# EAGLE design POV (EAGLE 9.6.2)

## Sheet 1 of 2
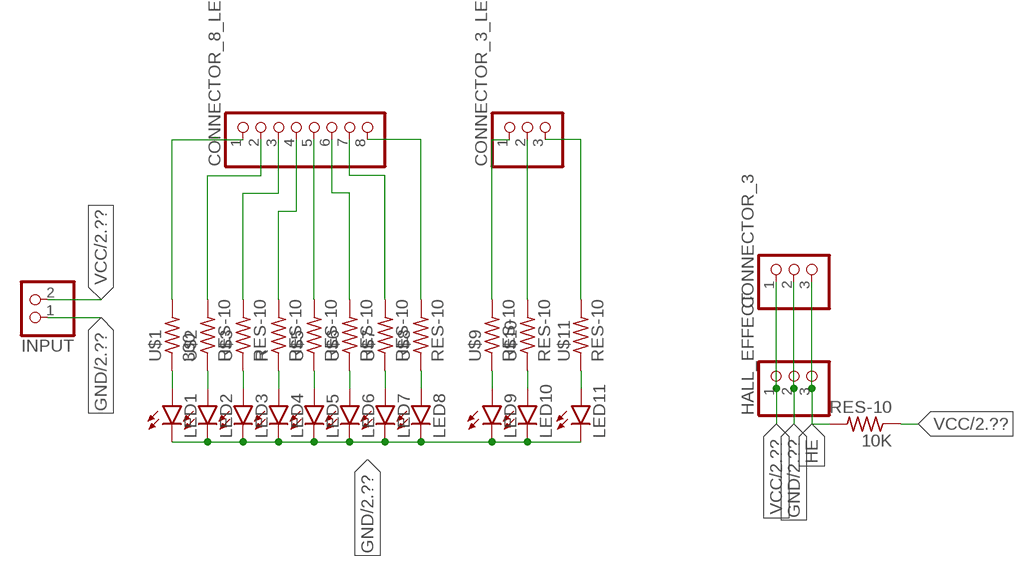
[diagram p0: schematic, sheet 1]

### Parts
10K  RES-10  [0207/10]
CONNECTOR_3  PINHD-1X3  [1X03]
CONNECTOR_3_LED  PINHD-1X3  [1X03]
CONNECTOR_8_LED  PINHD-1X8  [1X08]
HALL_EFFECT  PINHD-1X3  [1X03]
INPUT  PINHD-1X2  [1X02]
LED1  LED5MM  [LED5MM]
LED2  LED5MM  [LED5MM]
LED3  LED5MM  [LED5MM]
LED4  LED5MM  [LED5MM]
LED5  LED5MM  [LED5MM]
LED6  LED5MM  [LED5MM]
LED7  LED5MM  [LED5MM]
LED8  LED5MM  [LED5MM]
LED9  LED5MM  [LED5MM]
LED10  LED5MM  [LED5MM]
LED11  LED5MM  [LED5MM]
R  RES-10  [0207/10]
U$1  330  RES-10  [0207/10]
U$2  RES-10  [0207/10]
U$3  RES-10  [0207/10]
U$5  RES-10  [0207/10]
U$6  RES-10  [0207/10]
U$7  RES-10  [0207/10]
U$8  RES-10  [0207/10]
U$9  RES-10  [0207/10]
U$10  RES-10  [0207/10]
U$11  RES-10  [0207/10]

### Nets
GND: CONNECTOR_3.2 HALL_EFFECT.2 INPUT.1 LED1.K(C) LED2.K(C) LED3.K(C) LED4.K(C) LED5.K(C) LED6.K(C) LED7.K(C) LED8.K(C) LED9.K(C) LED10.K(C) LED11.K(C) ; also sheet 2
HE: 10K.2 CONNECTOR_3.3 HALL_EFFECT.3
N$2: LED1.A U$1.1
N$3: LED2.A U$2.1
N$4: LED3.A U$3.1
N$5: LED4.A R.1
N$6: LED5.A U$5.1
N$7: LED6.A U$6.1
N$8: LED7.A U$7.1
N$9: LED8.A U$8.1
N$10: LED9.A U$9.1
N$11: LED10.A U$10.1
N$12: LED11.A U$11.1
N$13: CONNECTOR_8_LED.1 U$1.2
N$14: CONNECTOR_8_LED.2 U$2.2
N$15: CONNECTOR_8_LED.3 U$3.2
N$16: CONNECTOR_8_LED.4 R.2
N$17: CONNECTOR_8_LED.5 U$5.2
N$18: CONNECTOR_8_LED.6 U$6.2
N$19: CONNECTOR_8_LED.7 U$7.2
N$20: CONNECTOR_8_LED.8 U$8.2
N$21: CONNECTOR_3_LED.1 U$9.2
N$22: CONNECTOR_3_LED.2 U$10.2
N$23: CONNECTOR_3_LED.3 U$11.2
VCC: 10K.1 CONNECTOR_3.1 HALL_EFFECT.1 INPUT.2 ; also sheet 2

## Sheet 2 of 2
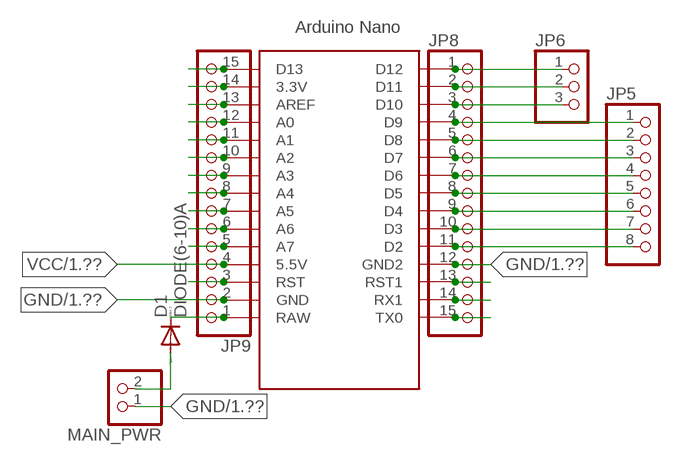
[diagram p1: schematic, sheet 2]

### Parts
D1  DIODE(6-10)A  [DO201-15]
JP5  PINHD-1X8  [1X08]
JP6  PINHD-1X3  [1X03]
JP8  PINHD-1X15  [1X15]
JP9  PINHD-1X15  [1X15]
MAIN_PWR  PINHD-1X2  [1X02]
U$12  ARDUINO_NANO  [NANO]

### Nets
GND: JP8.12 JP9.2 MAIN_PWR.1 U$12.GND U$12.GND1(GND2) ; also sheet 1
N$1: JP9.14 U$12.3.3V
N$24: JP9.13 U$12.AREF
N$25: JP8.15 U$12.TX0
N$26: JP8.14 U$12.RX1
N$27: JP8.13 U$12.RST1
N$29: JP5.8 JP8.11 U$12.D2
N$30: JP5.7 JP8.10 U$12.D3
N$31: JP5.6 JP8.9 U$12.D4
N$32: JP5.5 JP8.8 U$12.D5
N$33: JP5.4 JP8.7 U$12.D6
N$34: JP5.3 JP8.6 U$12.D7
N$35: JP5.2 JP8.5 U$12.D8
N$36: JP5.1 JP8.4 U$12.D9
N$37: D1.C JP9.1 U$12.RAW
N$38: D1.A MAIN_PWR.2
N$40: JP9.3 U$12.RST
N$59: JP9.9 U$12.A3
N$71: JP9.10 U$12.A2
N$77: JP9.11 U$12.A1
N$78: JP9.12 U$12.A0
N$79: JP9.15 U$12.D13
N$80: JP6.1 JP8.1 U$12.D12
N$81: JP6.2 JP8.2 U$12.D11
N$82: JP6.3 JP8.3 U$12.D10
N$83: JP9.5 U$12.A7
N$84: JP9.6 U$12.A6
N$85: JP9.7 U$12.A5
N$86: JP9.8 U$12.A4
VCC: JP9.4 U$12.5V(5.5V) ; also sheet 1

## Library data of the parts
10K R U$1-U$3 U$5-U$11 = MIA_LIBRARY-2-2-2:RES-10
CONNECTOR_3 CONNECTOR_3_LED HALL_EFFECT = pinhead:PINHD-1X3: PIN HEADER
CONNECTOR_8_LED = pinhead:PINHD-1X8: PIN HEADER
D1 = MIA_LIBRARY-2-2-2:DIODE(6-10)A: DIODE controlled avalanche rectifier
INPUT = pinhead:PINHD-1X2: PIN HEADER
JP5 = MIA_LIBRARY-2-2-2:PINHD-1X8: PIN HEADER
JP6 = MIA_LIBRARY-2-2-2:PINHD-1X3: PIN HEADER
JP8 JP9 = MIA_LIBRARY-2-2-2:PINHD-1X15: PIN HEADER
LED1-LED11 = led:LED: LED OSRAM: - CHIPLED LG R971, LG N971, LY N971, LG Q971, LY Q971, LO R971, LY R971 LH N974, LH R974 LS Q976, LO Q976, LY Q976 LO Q996 - Hyper CHIPLED LW Q18S LB Q993, LB Q99A, LB R99A - SideLED LS A670, LO A670, LY A670, LG A670, LP A670 LB A673, LV A673, LT A673, LW A673 LH A674 LY A675 LS A676, LA A676, LO A676, LY A676, LW A676 LS A679, LY A679, LG A679 - Hyper Micro SIDELED® LS Y876, LA Y876, LO Y876, LY Y876 LT Y87S - SmartLED LW L88C, LW L88S LB L89C, LB L89S, LG L890 LS L89K, LO L89K, LY L89K LS L896, LA L896, LO L896, LY L896 - TOPLED LS T670, LO T670, LY T670, LG T670, LP T670 LSG T670, LSP T670, LSY T670, LOP T670, LYG T670 LG T671, LOG T671, LSG T671 LB T673, LV T673, LT T673, LW T673 LH T674 LS T676, LA T676, LO T676, LY T676, LB T676, LH T676, LSB T676, LW T676 LB T67C, LV T67C, LT T67C, LS T67K, LO T67K, LY T67K, LW E67C LS E67B, LA E67B, LO E67B, LY E67B, LB E67C, LV E67C, LT E67C LW T67C LS T679, LY T679, LG T679 LS T770, LO T770, LY T770, LG T770, LP T770 LB T773, LV T773, LT T773, LW T773 LH T774 LS E675, LA E675, LY E675, LS T675 LS T776, LA T776, LO T776, LY T776, LB T776 LHGB T686 LT T68C, LB T68C - Hyper Mini TOPLED® LB M676 - Mini TOPLED Santana® LG M470 LS M47K, LO M47K, LY M47K Source: http://www.osram.convergy.de LUXEON: - LUMILED® LXK2-PW12-R00, LXK2-PW12-S00, LXK2-PW14-U00, LXK2-PW14-V00 LXK2-PM12-R00, LXK2-PM12-S00, LXK2-PM14-U00 LXK2-PE12-Q00, LXK2-PE12-R00, LXK2-PE12-S00, LXK2-PE14-T00, LXK2-PE14-U00 LXK2-PB12-K00, LXK2-PB12-L00, LXK2-PB12-M00, LXK2-PB14-N00, LXK2-PB14-P00, LXK2-PB14-Q00 LXK2-PR12-L00, LXK2-PR12-M00, LXK2-PR14-Q00, LXK2-PR14-R00 LXK2-PD12-Q00, LXK2-PD12-R00, LXK2-PD12-S00 LXK2-PH12-R00, LXK2-PH12-S00 LXK2-PL12-P00, LXK2-PL12-Q00, LXK2-PL12-R00 Source: www.luxeon.com KINGBRIGHT: KA-3528ASYC Source: www.kingbright.com
MAIN_PWR = MIA_LIBRARY-2-2-2:PINHD-1X2: PIN HEADER
U$12 = MIA_LIBRARY-2-2-2:ARDUINO_NANO: Arduino Nano

## Board
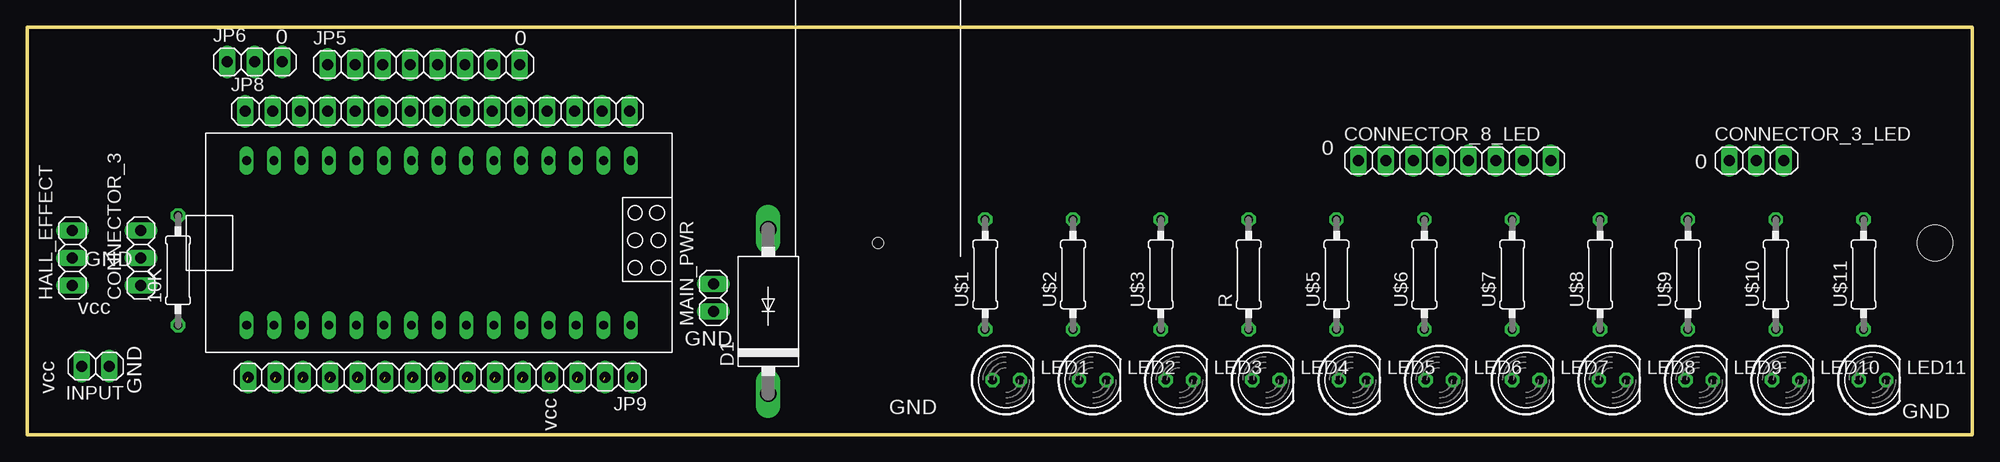
[diagram p2: board, top side]
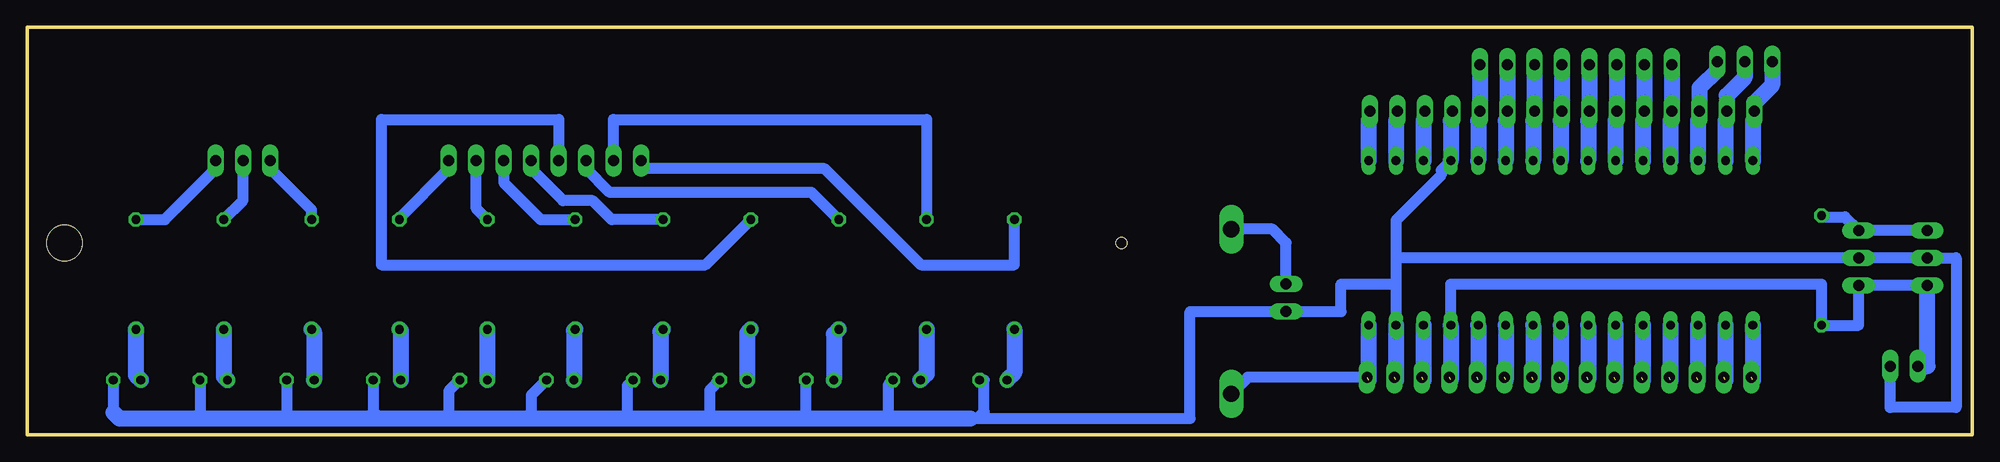
[diagram p3: board, bottom side, seen from below]

Size 180 x 37.77 mm. Coordinates in mm from the lower left corner, seen from the top.
Outline: 0,0 180,0 180,37.77 0,37.77 0,0
Copper layers (1*16): Top 0.035mm / dielectric 1.5mm / Bottom 0.035mm
Design rules "default *": minimum track width 1mm, minimum drill 0.35mm, track to track 0.5mm, track to pad 0.5mm, pad to pad 6mil, via to via 6mil, smd to smd 6mil, copper to edge 40mil, drill to drill 6mil, minimum pad ring 10mil, minimum via ring 8mil, stop-mask expansion 4mil, vias tented up to drill 0mil, thermal gap 10mil
Holes 3.3 mm at 176.53,17.78
Holes 1 mm at 78.74,17.78

### Footprints (pad centres in the part's own frame; a part is rotated, then mirrored left to right if it is on the bottom)
0207/10 = drill 0.813 octagon: 1 -5.08,0; 2 5.08,0
1X03 = drill 1.016 long: 1 -2.54,0; 2 0,0; 3 2.54,0
1X08 = drill 1.016 long: 1 -8.89,0; 2 -6.35,0; 3 -3.81,0; 4 -1.27,0; 5 1.27,0; 6 3.81,0; 7 6.35,0; 8 8.89,0
DO201-15 = drill 1.499 long: A 7.62,0; C -7.62,0
1X02 = drill 1.016 long: 1 -1.27,0; 2 1.27,0
1X15 = drill 1.016 long: 1 -17.78,0; 2 -15.24,0; 3 -12.7,0; 4 -10.16,0; 5 -7.62,0; 6 -5.08,0; 7 -2.54,0; 8 0,0; 9 2.54,0; 10 5.08,0; 11 7.62,0; 12 10.16,0; 13 12.7,0; 14 15.24,0; 15 17.78,0
LED5MM = drill 0.813 octagon: A -1.27,0; K 1.27,0
NANO = drill 0.8 long: 3.3V -10.16,24.13; 5V -10.16,-1.27; A0 -10.16,19.05; A1 -10.16,16.51; A2 -10.16,13.97; A3 -10.16,11.43; A4 -10.16,8.89; A5 -10.16,6.35; A6 -10.16,3.81; A7 -10.16,1.27; AREF -10.16,21.59; D2 5.08,1.27; D3 5.08,3.81; D4 5.08,6.35; D5 5.08,8.89; D6 5.08,11.43; D7 5.08,13.97; D8 5.08,16.51; D9 5.08,19.05; D10 5.08,21.59; D11 5.08,24.13; D12 5.08,26.67; D13 -10.16,26.67; GND -10.16,-6.35; GND1 5.08,-1.27; RAW -10.16,-8.89; RST -10.16,-3.81; RST1 5.08,-3.81; RX1 5.08,-6.35; TX0 5.08,-8.89

### Placement (x,y rotation side)
10K  13.97,15.24 90 top
CONNECTOR_3  10.54,16.38 90 top
CONNECTOR_3_LED  160.02,25.4 0 top
CONNECTOR_8_LED  132.08,25.4 0 top
D1  68.58,11.43 90 top
HALL_EFFECT  4.19,16.38 90 top
INPUT  6.35,6.35 180 top
JP5  36.7,34.29 0 top
JP6  21.08,34.54 0 top
JP8  37.97,29.97 0 top
JP9  38.23,5.33 180 top
LED1  90.59,5.08 0 top
LED2  98.61,5.08 0 top
LED3  106.62,5.08 0 top
LED4  114.64,5.08 0 top
LED5  122.65,5.08 0 top
LED6  130.67,5.08 0 top
LED7  138.68,5.08 0 top
LED8  146.7,5.08 0 top
LED9  154.71,5.08 0 top
LED10  162.73,5.08 0 top
LED11  170.74,5.08 0 top
MAIN_PWR  63.5,12.7 90 top
R  113.03,14.86 90 top
U$1  88.65,14.86 90 top
U$2  96.77,14.86 90 top
U$3  104.9,14.86 90 top
U$5  121.16,14.86 90 top
U$6  129.29,14.86 90 top
U$7  137.41,14.86 90 top
U$8  145.54,14.86 90 top
U$9  153.67,14.86 90 top
U$10  161.8,14.86 90 top
U$11  169.93,14.86 90 top
U$12  46.99,20.32 90 top

### Tracks (layer width: path | path; a pad name or v marks a point on that pad's centre or on a via)
GND  (1 unrouted)
  Bottom 1: LED11.K 172.01,2.08 | 171.45,1.52 163.83,1.52 | 163.83,1.52 156.21,1.52 | 156.21,1.52 147.32,1.52 | 147.32,1.52 140.97,1.52 | 140.97,1.52 133.35,1.52 | 133.35,1.52 124.46,1.52 | 124.46,1.52 116.84,1.52 | 116.84,1.52 107.95,1.52 | 107.95,1.52 100.33,1.52 | 100.33,1.52 92.71,1.52 92.08,1.52 | 92.08,1.52 91.44,2.15 91.44,5.08 LED1.K | LED2.K 100.33,4.63 100.33,1.52 | LED3.K 107.95,5.02 107.95,1.52 | LED4.K 116.84,4.15 116.84,1.52 | LED5.K 124.46,4.54 124.46,1.52 | LED6.K 133.35,3.67 133.35,1.52 | LED7.K 140.97,4.06 140.97,1.52 | LED8.K 147.97,2.17 147.32,1.52 | LED9.K 155.98,1.74 156.21,1.52 | LED10.K 164,1.69 163.83,1.52 | 53.34,13.97 58.42,13.97 58.42,11.43 MAIN_PWR.1 72.39,11.43 72.39,1.52 92.08,1.52 | 53.34,13.97 U$12.GND | CONNECTOR_3.2 HALL_EFFECT.2 1.52,16.38 1.52,2.54 7.62,2.54 INPUT.1 | 11.81,16.38 CONNECTOR_3.2 | U$12.GND1 49.15,24.51 49.15,24.06 53.34,19.87 53.34,16.51 | 53.34,16.51 53.34,13.97 | CONNECTOR_3.2 53.21,16.38 53.34,16.51
  Bottom 1.5: U$12.GND 53.34,5.08 | JP8.12 48.13,29.21 48.26,29.08 U$12.GND1 | 92.71,1.52 171.45,1.52 172.01,2.08
HE
  Bottom 1: HALL_EFFECT.3 CONNECTOR_3.3 11.81,20.19 13.84,20.19 10K.2
N$1  (1 unrouted)
  Bottom 1.5: U$12.3.3V 22.86,5.08
N$2
  Bottom 1.5: LED1.A 88.65,5.76 U$1.1
N$3
  Bottom 1.5: LED2.A 96.77,5.64 U$2.1
N$4
  Bottom 1.5: LED3.A 105.35,9.33 U$3.1
N$5
  Bottom 1.5: LED4.A 113.37,9.44 R.1
N$6
  Bottom 1.5: LED5.A 121.38,9.55 U$5.1
N$7
  Bottom 1.5: LED6.A 129.4,9.67 U$6.1
N$8
  Bottom 1.5: U$7.1 LED7.A | U$7.1
N$9
  Bottom 1.5: LED8.A 145.43,9.67 U$8.1
N$10
  Bottom 1.5: LED9.A 153.44,9.55 U$9.1
N$11
  Bottom 1.5: LED10.A 161.8,5.42 U$10.1
N$12
  Bottom 1.5: LED11.A 169.93,5.53 U$11.1
N$13
  Bottom 1: CONNECTOR_8_LED.1 123.19,24.64 106.2,24.64 97.3,15.74 88.65,15.74 U$1.2
N$14
  Bottom 1: CONNECTOR_8_LED.2 125.73,29.19 96.77,29.19 U$2.2
N$15
  Bottom 1: CONNECTOR_8_LED.3 128.27,24.64 126.09,22.45 107.42,22.45 U$3.2
N$16
  Bottom 1: CONNECTOR_8_LED.4 130.81,29.19 147.2,29.19 147.2,15.74 117.23,15.74 R.2
N$17
  Bottom 1: CONNECTOR_8_LED.5 133.35,24.64 130.4,21.69 127.66,21.69 125.91,19.94 U$5.2
N$18
  Bottom 1: CONNECTOR_8_LED.6 135.89,23.37 132.46,19.94 U$6.2
N$19
  Bottom 1: U$7.2 138.43,20.95 CONNECTOR_8_LED.7
N$20
  Bottom 1: CONNECTOR_8_LED.8 140.97,24.64 145.54,20.07 U$8.2
N$21
  Bottom 1: CONNECTOR_3_LED.1 157.48,24.64 153.67,20.83 U$9.2
N$22
  Bottom 1: U$10.2 160.02,21.72 CONNECTOR_3_LED.2
N$23
  Bottom 1: CONNECTOR_3_LED.3 162.56,24.64 167.26,19.94 U$11.2
N$24  (1 unrouted)
  Bottom 1.5: U$12.AREF 25.4,5.08
N$25
  Bottom 1.5: JP8.15 55.75,29.21 55.88,29.08 U$12.TX0
N$26
  Bottom 1.5: JP8.14 53.21,29.21 53.34,29.08 U$12.RX1
N$27
  Bottom 1.5: JP8.13 50.67,29.21 50.8,29.08 U$12.RST1
N$29
  Bottom 1.5: U$12.D2 45.72,29.08 45.59,29.21 JP8.11 JP5.8
N$30
  Bottom 1.5: U$12.D3 43.18,29.08 43.05,29.21 JP8.10 JP5.7
N$31
  Bottom 1.5: U$12.D4 40.64,29.08 40.51,29.21 JP8.9 JP5.6
N$32
  Bottom 1.5: U$12.D5 38.1,29.08 37.97,29.21 JP8.8 JP5.5
N$33
  Bottom 1.5: U$12.D6 35.56,29.08 35.43,29.21 JP8.7 JP5.4
N$34
  Bottom 1.5: U$12.D7 33.02,29.08 32.89,29.21 JP8.6 JP5.3
N$35
  Bottom 1.5: U$12.D8 30.48,29.08 30.35,29.21 JP8.5 JP5.2
N$36
  Bottom 1.5: U$12.D9 27.94,29.08 27.81,29.21 JP8.4 JP5.1
N$37  (1 unrouted)
  Bottom 1: JP9.1 67.06,5.33 D1.C
  Bottom 1.5: U$12.RAW 55.88,5.08
N$38
  Bottom 1: MAIN_PWR.2 63.5,17.78 64.77,19.05 D1.A
N$40  (1 unrouted)
  Bottom 1.5: U$12.RST 50.8,5.08
N$59  (1 unrouted)
  Bottom 1.5: U$12.A3 35.56,5.08
N$71  (1 unrouted)
  Bottom 1.5: U$12.A2 33.02,5.08
N$77  (1 unrouted)
  Bottom 1.5: U$12.A1 30.48,5.08
N$78  (1 unrouted)
  Bottom 1.5: U$12.A0 27.94,5.08
N$79  (1 unrouted)
  Bottom 1.5: U$12.D13 20.32,5.08
N$80
  Bottom 1.5: U$12.D12 20.32,29.08 20.19,29.21 JP8.1 20.19,30.73 18.54,32.38 JP6.1
N$81
  Bottom 1.5: U$12.D11 22.86,29.08 22.73,29.21 JP8.2 22.73,31.43 21.08,33.08 JP6.2
N$82
  Bottom 1.5: U$12.D10 25.4,29.08 25.27,29.21 JP8.3 25.27,32.13 23.62,33.78 JP6.3
N$83  (1 unrouted)
  Bottom 1.5: U$12.A7 45.72,5.08
N$84  (1 unrouted)
  Bottom 1.5: U$12.A6 43.18,5.08
N$85  (1 unrouted)
  Bottom 1.5: U$12.A5 40.64,5.08
N$86  (1 unrouted)
  Bottom 1.5: U$12.A4 38.1,5.08
VCC  (1 unrouted)
  Bottom 1: HALL_EFFECT.1 CONNECTOR_3.1 10.54,10.16 10K.1 13.97,13.97 48.26,13.97 U$12.5V
  Bottom 1.5: U$12.5V 48.26,5.08 | INPUT.2 4.18,6.35 HALL_EFFECT.1

### Text on the board
tPlace: 0 | 0 | 0 | 0 | GND | vcc | GND | vcc | GND | GND | GND | vcc